# EAGLE design PCA9685 (EAGLE 8.1.1)
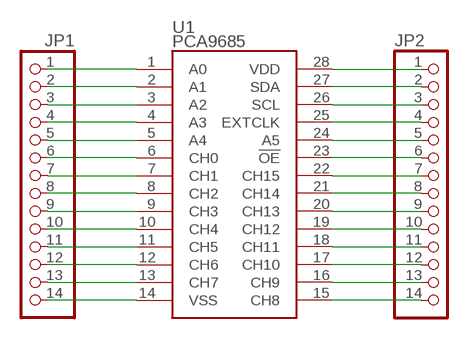
[diagram p0: schematic, sheet 1]

## Parts
JP1  PINHD-1X14ROUND  [1X14_ROUND]
JP2  PINHD-1X14ROUND  [1X14_ROUND]
U1  PCA9685  [TSSOP-28_4MM]

## Nets
N$1: JP1.1 U1.1(A0)
N$2: JP1.2 U1.2(A1)
N$3: JP1.3 U1.3(A2)
N$4: JP1.4 U1.4(A3)
N$5: JP1.5 U1.5(A4)
N$6: JP1.6 U1.6(CH0)
N$7: JP1.7 U1.7(CH1)
N$8: JP1.8 U1.8(CH2)
N$9: JP1.9 U1.9(CH3)
N$10: JP1.10 U1.10(CH4)
N$11: JP1.11 U1.11(CH5)
N$12: JP1.12 U1.12(CH6)
N$13: JP1.13 U1.13(CH7)
N$14: JP1.14 U1.14(VSS)
N$15: JP2.1 U1.28(VDD)
N$16: JP2.2 U1.27(SDA)
N$17: JP2.3 U1.26(SCL)
N$18: JP2.4 U1.25(EXTCLK)
N$19: JP2.5 U1.24(A5)
N$20: JP2.6 U1.23(!OE)
N$21: JP2.7 U1.22(CH15)
N$22: JP2.8 U1.21(CH14)
N$23: JP2.9 U1.20(CH13)
N$24: JP2.10 U1.19(CH12)
N$25: JP2.11 U1.18(CH11)
N$26: JP2.12 U1.17(CH10)
N$27: JP2.13 U1.16(CH9)
N$28: JP2.14 U1.15(CH8)

## Library data of the parts
JP1 JP2 = pinhead:PINHD-1X14: PIN HEADER
U1 = NXP:PCA9685: 16-channel 12-bit PWM I2C interface Internal Oscillator 40Hz to 1kHz Can be totem pole or open collector 2.3V to 5.5V; PROD_ID: IC-12240

## Board
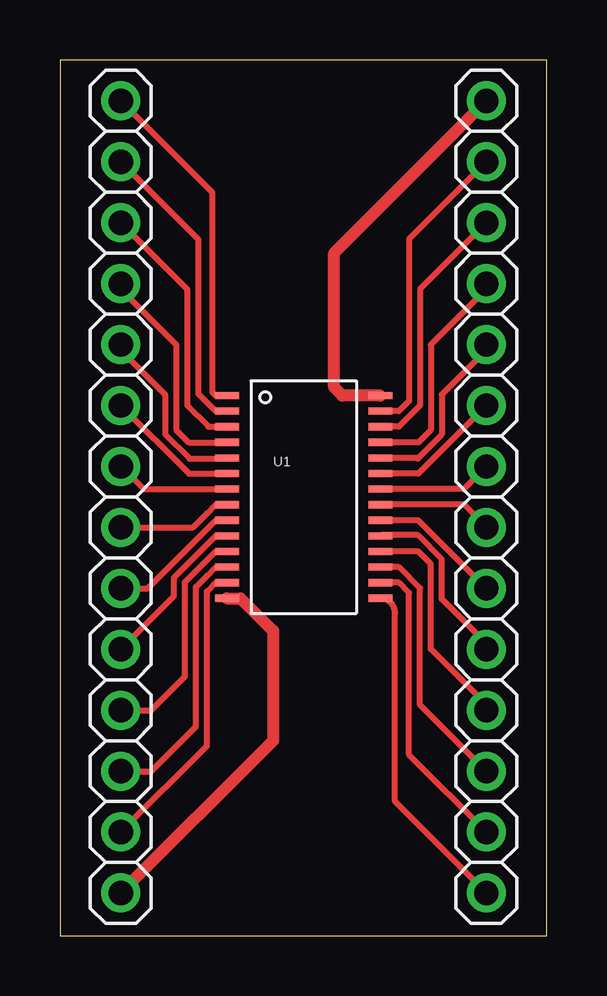
[diagram p1: board, top side]

Size 20.3 x 36.5 mm. Coordinates in mm from the lower left corner, seen from the top.
Outline: 0,0 20.3,0 20.3,36.5 0,36.5 0,0
Copper layers (1*16): Top 0.035mm / dielectric 1.5mm / Bottom 0.035mm
Design rules "SparkFun": minimum track width 8mil, minimum drill 20mil, track to track 8mil, track to pad 8mil, pad to pad 8mil, via to via 8mil, smd to smd 8mil, copper to edge 8mil, drill to drill 8mil, minimum pad ring 12mil, minimum via ring 10mil, stop-mask expansion 4mil, vias tented up to drill 20mil, thermal gap 10mil

### Footprints (pad centres in the part's own frame; a part is rotated, then mirrored left to right if it is on the bottom)
1X14_ROUND = drill 1.016: 1 -16.51,0; 2 -13.97,0; 3 -11.43,0; 4 -8.89,0; 5 -6.35,0; 6 -3.81,0; 7 -1.27,0; 8 1.27,0; 9 3.81,0; 10 6.35,0; 11 8.89,0; 12 11.43,0; 13 13.97,0; 14 16.51,0
TSSOP-28_4MM = smd 1 x 0.3: 1 -3.2,4.225; 2 -3.2,3.575; 3 -3.2,2.925; 4 -3.2,2.275; 5 -3.2,1.625; 6 -3.2,0.975; 7 -3.2,0.325; 8 -3.2,-0.325; 9 -3.2,-0.975; 10 -3.2,-1.625; 11 -3.2,-2.275; 12 -3.2,-2.925; 13 -3.2,-3.575; 14 -3.2,-4.225; 15 3.2,-4.225; 16 3.2,-3.575; 17 3.2,-2.925; 18 3.2,-2.275; 19 3.2,-1.625; 20 3.2,-0.975; 21 3.2,-0.325; 22 3.2,0.325; 23 3.2,0.975; 24 3.2,1.625; 25 3.2,2.275; 26 3.2,2.925; 27 3.2,3.575; 28 3.2,4.225

### Placement (x,y rotation side)
JP1  2.54,18.28 270 top
JP2  17.78,18.28 270 top
U1  10.16,18.28 0 top

### Tracks (layer width: path | path; a pad name or v marks a point on that pad's centre or on a via)
N$1
  Top 0.254: JP1.1 6.35,30.98 6.35,22.65 6.49,22.51 U1.1
N$2
  Top 0.254: JP1.2 5.77,29.03 5.77,22.59 6.49,21.86 U1.2
N$3
  Top 0.254: JP1.3 5.31,26.95 5.31,22.09 6.19,21.21 U1.3
N$4
  Top 0.254: JP1.4 2.54,26.94 4.85,24.63 4.85,21.08 5.37,20.56 U1.4
N$5
  Top 0.254: JP1.5 2.54,24.4 4.39,22.55 4.39,20.89 5.4,19.88 6.93,19.88 U1.5
N$6
  Top 0.254: JP1.6 5.38,19.26 U1.6
N$7
  Top 0.254: JP1.7 3.48,18.61 U1.7
N$8
  Top 0.254: JP1.8 5.55,17.01 6.13,17.59 6.13,17.6 6.49,17.96 U1.8
N$9
  Top 0.254: JP1.9 3.67,14.47 5.67,16.48 5.67,16.49 6.49,17.31 U1.9
N$10
  Top 0.254: JP1.10 4.76,14.15 4.76,14.92 6.13,16.29 6.13,16.3 6.49,16.66 U1.10
N$11
  Top 0.254: JP1.11 3.81,9.39 5.21,10.8 5.21,14.73 6.49,16.01 U1.11
N$12
  Top 0.254: JP1.12 3.81,6.85 5.67,8.72 5.67,14.54 6.13,14.99 6.13,15 6.49,15.36 U1.12
N$13
  Top 0.254: JP1.13 6.13,7.9 6.13,14.35 6.49,14.71 U1.13
N$14
  Top 0.508: U1.14 7.53,14.06 8.89,12.7 8.89,8.12 JP1.14
N$15
  Top 0.508: U1.28 11.78,22.51 11.43,22.86 11.43,28.44 JP2.1
N$16
  Top 0.254: JP2.2 14.55,29.03 14.55,22.28 14.13,21.86 U1.27
N$17
  Top 0.254: JP2.3 15.01,26.95 15.01,22.09 14.13,21.21 U1.26
N$18
  Top 0.254: JP2.4 17.78,26.94 15.47,24.63 15.47,21.08 14.95,20.56 U1.25
N$19
  Top 0.254: JP2.5 17.78,24.4 15.93,22.55 15.93,20.89 14.92,19.88 14.88,19.91 U1.24
N$20
  Top 0.254: JP2.6 14.95,19.26 U1.23
N$21
  Top 0.254: JP2.7 16.84,18.61 U1.22
N$22
  Top 0.254: JP2.8 16.84,17.96 U1.21
N$23
  Top 0.254: JP2.9 14.95,17.31 U1.20
N$24
  Top 0.254: JP2.10 17.78,12.17 15.93,14.02 15.93,15.68 14.92,16.69 13.39,16.69 U1.19
N$25
  Top 0.254: JP2.11 17.78,9.63 15.47,11.94 15.47,15.49 14.95,16.01 U1.18
N$26
  Top 0.254: JP2.12 15.01,9.62 15.01,14.47 14.13,15.36 U1.17
N$27
  Top 0.254: JP2.13 14.55,7.54 14.55,14.28 14.13,14.71 U1.16
N$28
  Top 0.254: JP2.14 13.97,5.58 13.97,13.45 arc90 U1.15